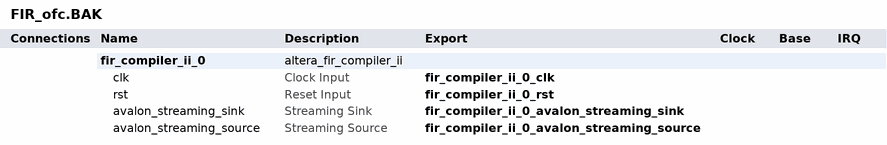
[diagram p0: system contents]
# Platform Designer (Qsys) system FIR_ofc.BAK, Cyclone V 5CGXFC5C6F27C7
# Parameters at their usual value, and those the tool derives, are not listed.
package require -exact qsys 16.1
create_system FIR_ofc.BAK
set_project_property DEVICE_FAMILY {Cyclone V}
set_project_property DEVICE 5CGXFC5C6F27C7

add_instance fir_compiler_ii_0 altera_fir_compiler_ii 16.1
set_instance_parameter_value fir_compiler_ii_0 coeffBitWidth 19
set_instance_parameter_value fir_compiler_ii_0 coeffFracBitWidth 0
set_instance_parameter_value fir_compiler_ii_0 coeffReload false
set_instance_parameter_value fir_compiler_ii_0 coeffType int
set_instance_parameter_value fir_compiler_ii_0 inputBitWidth 14
set_instance_parameter_value fir_compiler_ii_0 inputChannelNum 1
set_instance_parameter_value fir_compiler_ii_0 inputFracBitWidth 0
set_instance_parameter_value fir_compiler_ii_0 inputRate 40
set_instance_parameter_value fir_compiler_ii_0 inputType int
set_instance_parameter_value fir_compiler_ii_0 outLsbBitRem 0
set_instance_parameter_value fir_compiler_ii_0 outMsbBitRem 0
set_instance_parameter_value fir_compiler_ii_0 outType int
set_instance_parameter_value fir_compiler_ii_0 readWriteMode read_write
set_instance_parameter_value fir_compiler_ii_0 speedGrade medium

# exported interfaces
add_interface fir_compiler_ii_0_avalon_streaming_sink avalon_streaming sink
set_interface_property fir_compiler_ii_0_avalon_streaming_sink EXPORT_OF fir_compiler_ii_0.avalon_streaming_sink
add_interface fir_compiler_ii_0_avalon_streaming_source avalon_streaming source
set_interface_property fir_compiler_ii_0_avalon_streaming_source EXPORT_OF fir_compiler_ii_0.avalon_streaming_source
add_interface fir_compiler_ii_0_clk clock sink
set_interface_property fir_compiler_ii_0_clk EXPORT_OF fir_compiler_ii_0.clk
add_interface fir_compiler_ii_0_rst reset sink
set_interface_property fir_compiler_ii_0_rst EXPORT_OF fir_compiler_ii_0.rst

set_interconnect_requirement {$system} qsys_mm.clockCrossingAdapter HANDSHAKE
set_interconnect_requirement {$system} qsys_mm.enableEccProtection FALSE
set_interconnect_requirement {$system} qsys_mm.insertDefaultSlave FALSE
set_interconnect_requirement {$system} qsys_mm.maxAdditionalLatency 1

save_system FIR_ofc.BAK.qsys
